# Altium schematic sheet Connectors.SchDoc
size 431 x 279 mm; SheetNumber: 1; SheetTotal: 1
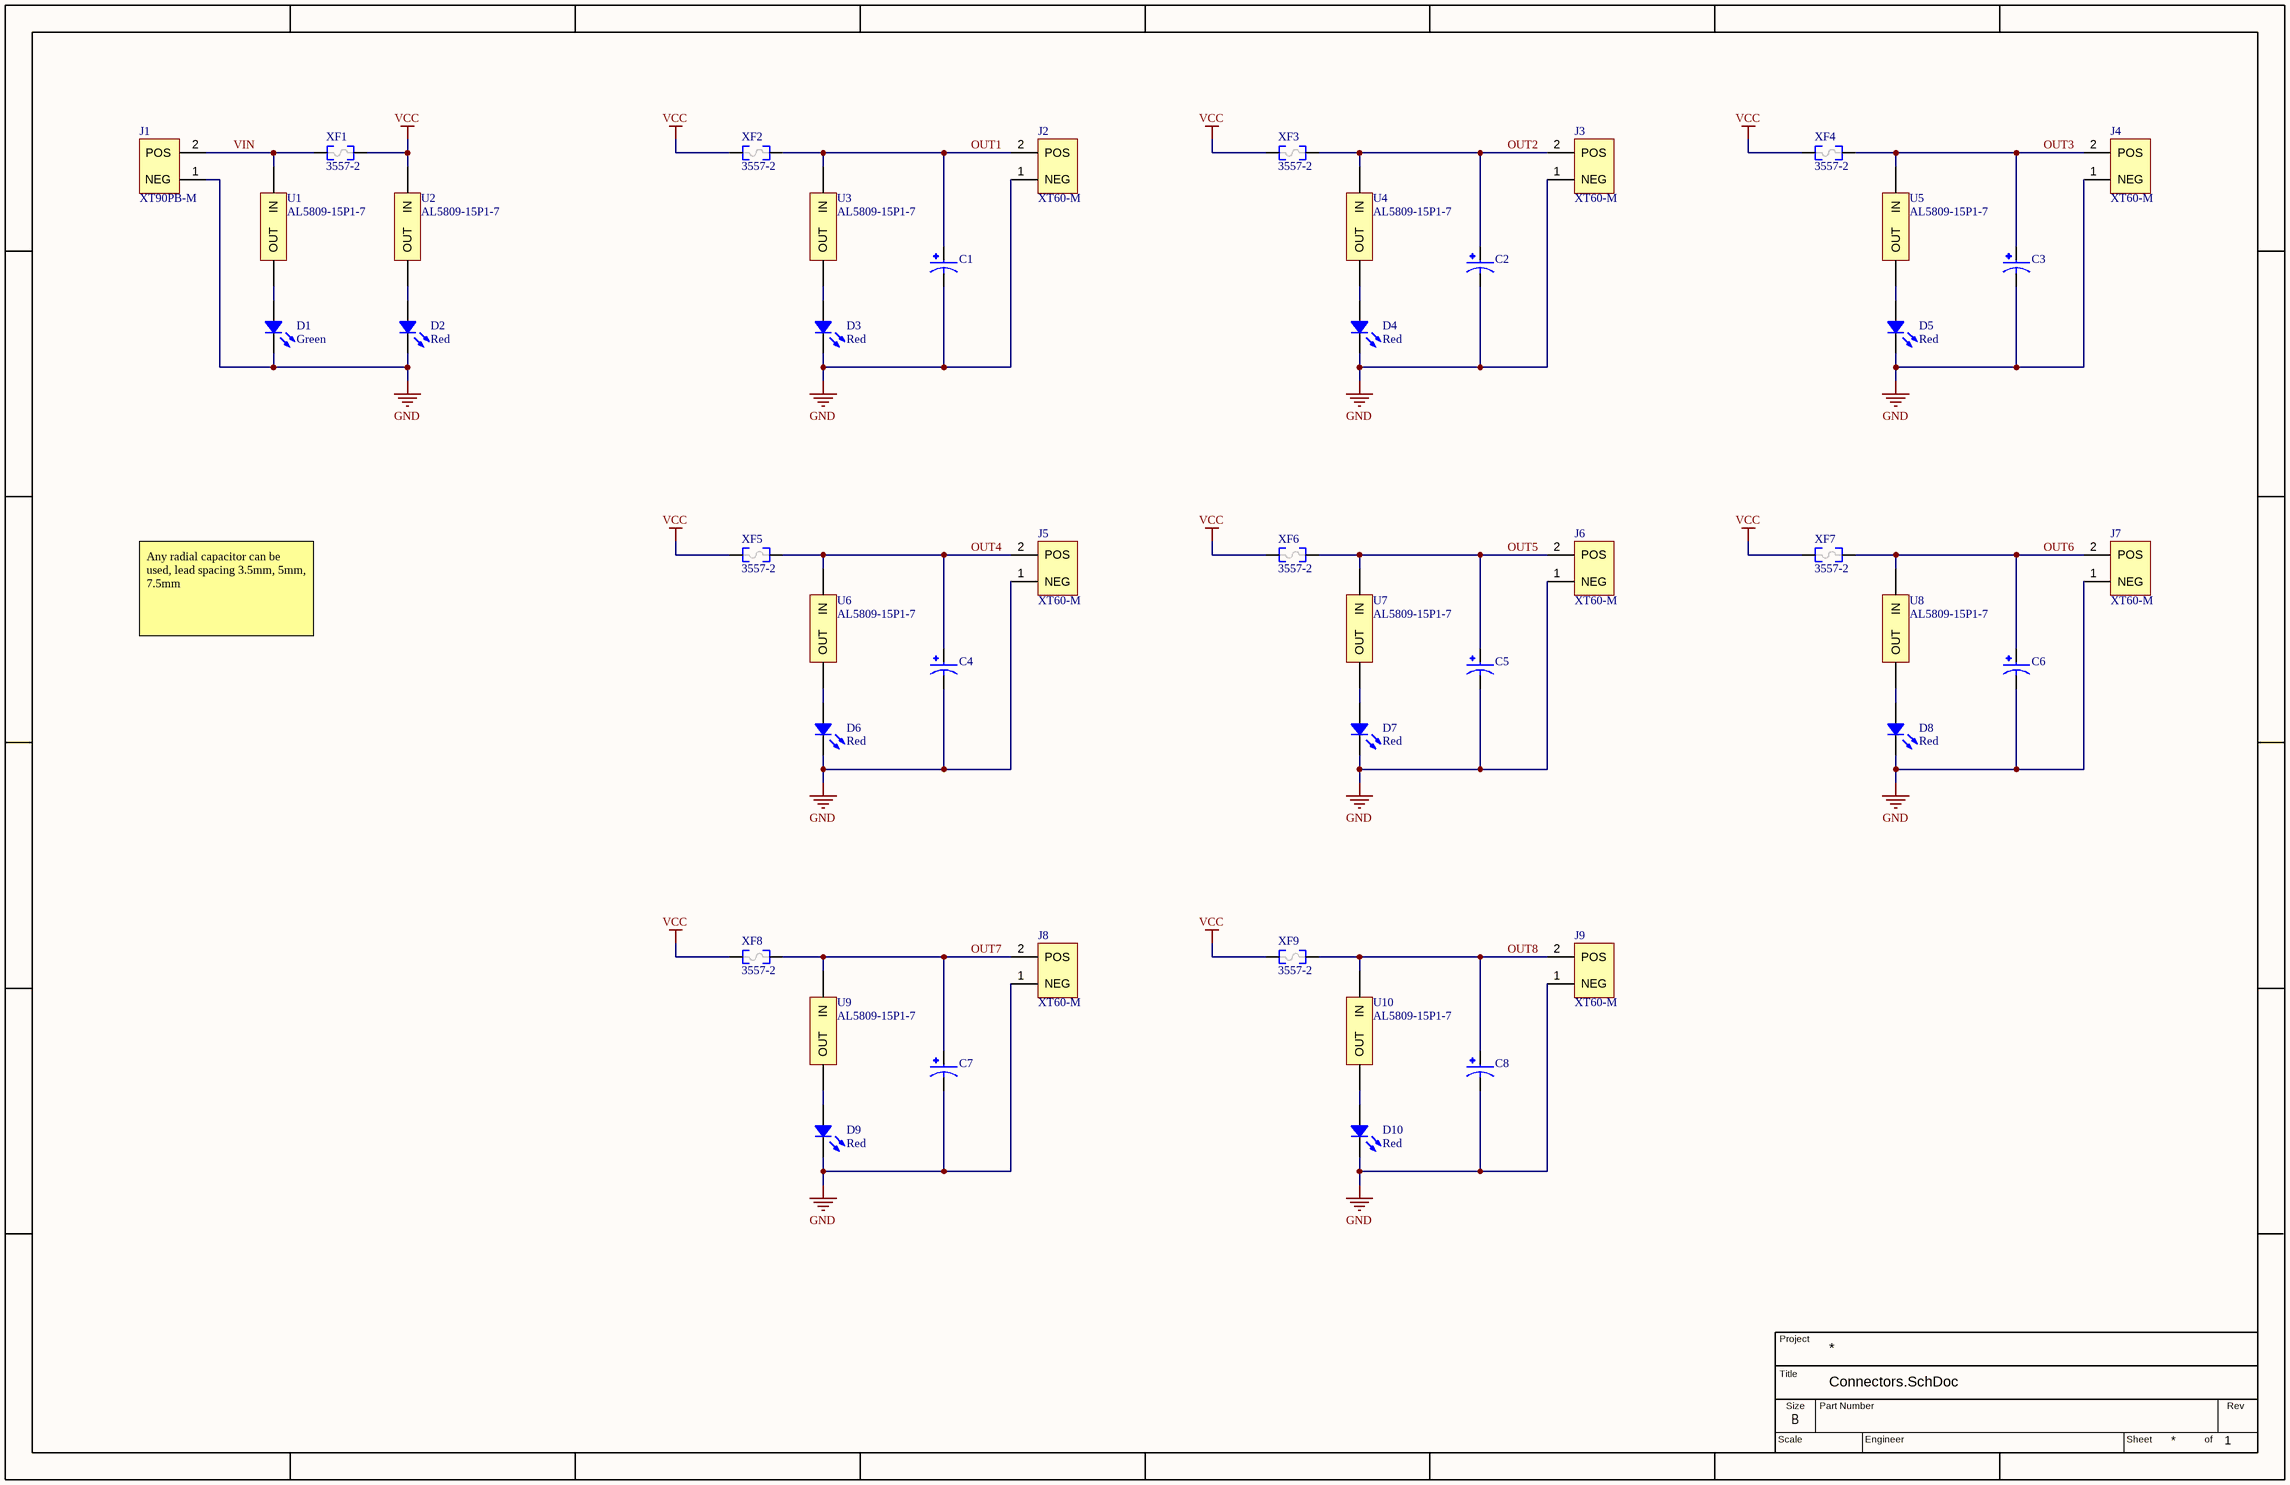
[diagram p0: Connectors.SchDoc]

## Parts
C1  Capacitor Generic  [RADIAL_CAP_10mm]  (value not drawn)
C2  Capacitor Generic  [RADIAL_CAP_10mm]  (value not drawn)
C3  Capacitor Generic  [RADIAL_CAP_10mm]  (value not drawn)
C4  Capacitor Generic  [RADIAL_CAP_10mm]  (value not drawn)
C5  Capacitor Generic  [RADIAL_CAP_10mm]  (value not drawn)
C6  Capacitor Generic  [RADIAL_CAP_10mm]  (value not drawn)
C7  Capacitor Generic  [RADIAL_CAP_10mm]  (value not drawn)
C8  Capacitor Generic  [RADIAL_CAP_10mm]  (value not drawn)
D1  Green  [LED 0603_1608 GREEN]
D2  Red  [LED 0603_1608 RED]
D3  Red  [LED 0603_1608 RED]
D4  Red  [LED 0603_1608 RED]
D5  Red  [LED 0603_1608 RED]
D6  Red  [LED 0603_1608 RED]
D7  Red  [LED 0603_1608 RED]
D8  Red  [LED 0603_1608 RED]
D9  Red  [LED 0603_1608 RED]
D10  Red  [LED 0603_1608 RED]
J1  XT90PB-M  [XT90PB-M]
J2  XT60-M  [AMASS_XT60-M]
J3  XT60-M  [AMASS_XT60-M]
J4  XT60-M  [AMASS_XT60-M]
J5  XT60-M  [AMASS_XT60-M]
J6  XT60-M  [AMASS_XT60-M]
J7  XT60-M  [AMASS_XT60-M]
J8  XT60-M  [AMASS_XT60-M]
J9  XT60-M  [AMASS_XT60-M]
U1  AL5809-15P1-7  [POWERDI_123]
U2  AL5809-15P1-7  [POWERDI_123]
U3  AL5809-15P1-7  [POWERDI_123]
U4  AL5809-15P1-7  [POWERDI_123]
U5  AL5809-15P1-7  [POWERDI_123]
U6  AL5809-15P1-7  [POWERDI_123]
U7  AL5809-15P1-7  [POWERDI_123]
U8  AL5809-15P1-7  [POWERDI_123]
U9  AL5809-15P1-7  [POWERDI_123]
U10  AL5809-15P1-7  [POWERDI_123]
XF1  3557-2  [FUSE_3557-2]
XF2  3557-2  [FUSE_3557-2]
XF3  3557-2  [FUSE_3557-2]
XF4  3557-2  [FUSE_3557-2]
XF5  3557-2  [FUSE_3557-2]
XF6  3557-2  [FUSE_3557-2]
XF7  3557-2  [FUSE_3557-2]
XF8  3557-2  [FUSE_3557-2]
XF9  3557-2  [FUSE_3557-2]

## Nets
GND: C1.1 C2.1 C3.1 C4.1 C5.1 C6.1 C7.1 C8.1 D1.2 D2.2 D3.2 D4.2 D5.2 D6.2 D7.2 D8.2 D9.2 D10.2 J1.1(NEG) J2.1(NEG) J3.1(NEG) J4.1(NEG) J5.1(NEG) J6.1(NEG) J7.1(NEG) J8.1(NEG) J9.1(NEG)
VCC: U2.1(IN) XF1.2 XF2.1 XF3.1 XF4.1 XF5.1 XF6.1 XF7.1 XF8.1 XF9.1
OUT1: C1.2 J2.2(POS) U3.1(IN) XF2.2
OUT2: C2.2 J3.2(POS) U4.1(IN) XF3.2
OUT3: C3.2 J4.2(POS) U5.1(IN) XF4.2
OUT4: C4.2 J5.2(POS) U6.1(IN) XF5.2
OUT5: C5.2 J6.2(POS) U7.1(IN) XF6.2
OUT6: C6.2 J7.2(POS) U8.1(IN) XF7.2
OUT7: C7.2 J8.2(POS) U9.1(IN) XF8.2
OUT8: C8.2 J9.2(POS) U10.1(IN) XF9.2
VIN: J1.2(POS) U1.1(IN) XF1.1
NetD1_1: D1.1 U1.2(OUT)
NetD2_1: D2.1 U2.2(OUT)
NetD3_1: D3.1 U3.2(OUT)
NetD4_1: D4.1 U4.2(OUT)
NetD5_1: D5.1 U5.2(OUT)
NetD6_1: D6.1 U6.2(OUT)
NetD7_1: D7.1 U7.2(OUT)
NetD8_1: D8.1 U8.2(OUT)
NetD9_1: D9.1 U9.2(OUT)
NetD10_1: D10.1 U10.2(OUT)

## Notes on the sheet
- Any radial capacitor can be used, lead spacing 3.5mm, 5mm, 7.5mm
- Title
- Project
- Scale
- Size
- B
- Part Number
- Engineer
- Sheet
- of
- Rev

## Library data of the parts
C1-C8 = Capacitor Generic: Cap Radial Aluminum Cylindrical Can 3.5mm, 5mm; MF: Panasonic; MP: ECA-2WHG220; Package: RADIAL-2 Panasonic; Value: *; Availability: In Stock; Check_prices: https://www.snapeda.com/parts/ECA-2WHG220/Panasonic/view-part/390097/?ref=eda; Price: None; SnapEDA_Link: https://www.snapeda.com/parts/ECA-2WHG220/Panasonic/view-part/390097/?ref=snap
D1 = LTST-C193TGKT-5A: LED GREEN CLEAR CHIP SMD; Manufacturer: Lite-On Inc.; Configuration: Standard; Current - Test: 5mA; Lens Color: Colorless; Lens Size: 1.15mm x 0.80mm; Lens Style: Rectangle with Flat Top; Millicandela Rating: 154mcd; Viewing Angle: 130°; Voltage - Forward (Vf) (Typ): 2.8V; Wavelength - Dominant: 528nm; Wavelength - Peak: 525nm; Part Number: LTST-C193TGKT-5A; Color: Green; ComponentLink1Description: Datasheet; ComponentLink1URL: //media.digikey.com/pdf/Data%20Sheets/Lite-On%20PDFs/LTST-C193TGKT-5A.pdf; ComponentLink2Description: DigiKey Link; ComponentLink2URL: http://digikey.com/product-detail/en/lite-on-inc/LTST-C193TGKT-5A/160-1832-1-ND/2356255; Device Package: 0603 (1608 Metric); Height (Max): 0.45mm; LastUpdated: 9/2/2020 1:20:42 AM; Lens Transparency: Clear; Lifecycle Status: Active; Minimum Order: 1; Mounting Type: Surface Mount; Package / Case: 0603 (1608 Metric); Packaging: TapeAndReel; PartId: 644; Part Status: Active; Price: 0.10; Series: -; Size / Dimension: 1.60mm L x 0.80mm W; Supplier 1: DigiKey; Supplier Part Number 1: 160-1832-1-ND; Supplier Device Package: Chip LED; Value: Green
D2-D10 = 19-217/R6C-AL1M2VY/3T: LED RED CLEAR 2SMD; Manufacturer: Everlight Electronics Co Ltd; Configuration: Standard; Current - Test: 5mA; Lens Color: Colorless; Lens Size: 1.00mm x 0.80mm; Lens Style: Rectangle with Flat Top; Viewing Angle: 120°; Voltage - Forward (Vf) (Typ): 1.95V; Wavelength - Peak: 632nm; Part Number: 19-217/R6C-AL1M2VY/3T; Color: Red; ComponentLink1Description: Datasheet; ComponentLink1URL: //media.digikey.com/pdf/Data%20Sheets/Everlight%20PDFs/19-217-R6C-AL1M2VY-3T.pdf; ComponentLink2Description: DigiKey Link; ComponentLink2URL: http://digikey.com/product-detail/en/everlight-electronics-co-ltd/19-217-R6C-AL1M2VY-3T/1080-1585-1-ND/8535308; Device Package: 0603 (1608 Metric); Height (Max): 0.50mm; LastUpdated: 9/2/2020 1:20:56 AM; Lens Transparency: Clear; Lifecycle Status: Active; Minimum Order: 1; Mounting Type: Surface Mount; Package / Case: 0603 (1608 Metric); Packaging: TapeAndReel; PartId: 419; Part Status: Active; Price: 0.05; Series: -; Size / Dimension: 1.60mm L x 0.80mm W; Supplier 1: DigiKey; Supplier Part Number 1: 1080-1585-1-ND; Supplier Device Package: 2-SMD; Value: Red
J1 = XT90PB-M: Plug; DC supply; XT60; male; PIN: 2; for cable; soldered; 30A; 500V; MP: XT60-M; MF: AMASS; Price: None; Package: Package Analog Devices; Value: *; Availability: Unavailable; SnapEDA_Link: https://www.snapeda.com/parts/XT60-M/AMASS/view-part/2883912/?ref=snap
J2-J9 = XT60-M: Plug; DC supply; XT60; male; PIN: 2; for cable; soldered; 30A; 500V; MF: AMASS; MP: XT60-M; Price: None; Package: Package Analog Devices; Value: *; Availability: Unavailable; SnapEDA_Link: https://www.snapeda.com/parts/XT60-M/AMASS/view-part/2883912/?ref=snap
U1-U10 = AL5809-15P1-7: LED Driver IC 1 Output Linear - PWM Dimming 15mA PowerDI™ 123
XF1-XF9 = 3557-2: Fuse Block 30A 500V 1 Circuit Blade Through Hole; MF: Keystone Electronics; Package: Nonstandard Keystone; Value: *; Price: None; MP: 3557-2; SnapEDA_Link: https://www.snapeda.com/parts/3557-2/Keystone%20Electronics/view-part/278060/?ref=snap; Availability: Unavailable